# EAGLE design LDAQ-MOD-4AMPINP (EAGLE 6.6.0)
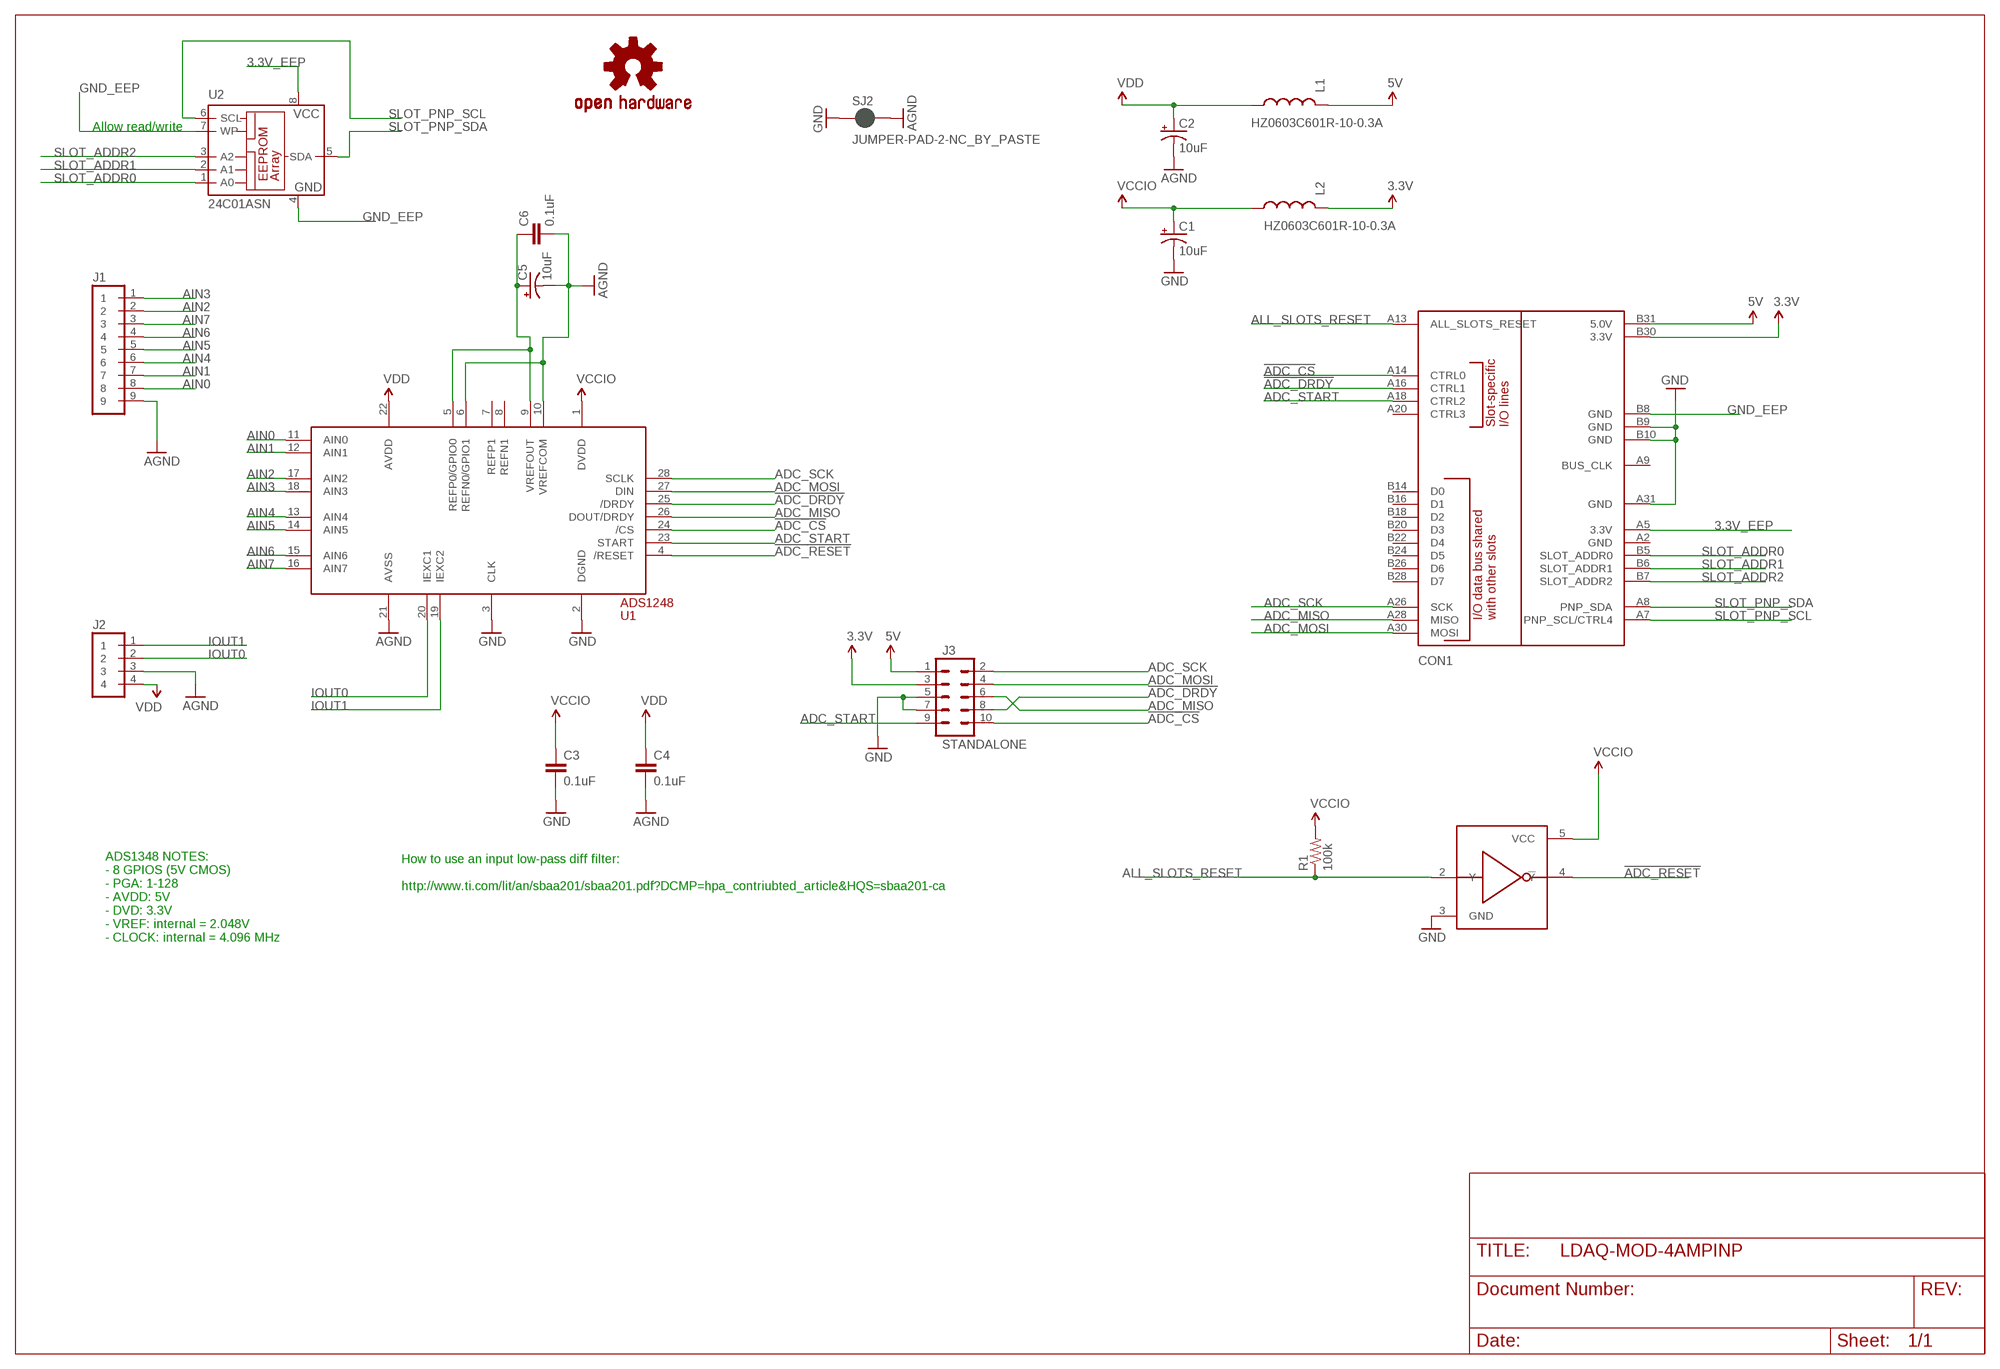
[diagram p0: schematic, sheet 1]

## Parts
C1  10uF  CAP_POL1206  [EIA3216]
C2  10uF  CAP_POL1206  [EIA3216]
C3  0.1uF  0.1UF-25V-5%(0603)  [0603-CAP]
C4  0.1uF  0.1UF-25V-5%(0603)  [0603-CAP]
C5  10uF  CAP_POL1206  [EIA3216]
C6  0.1uF  0.1UF-25V-5%(0603)  [0603-CAP]
CON1  BOARD  LIBREDAQ_DAUGHTER_BOARDPCIE-64-SIZE2-PADS  [PCI-E_64_EDGE_63X50_PADS-ONLY]
J1  SCREWTERMINAL-3.5MM-9  [SCREWTERMINAL-3.5MM-9]
J2  SCREWTERMINAL-3.5MM-4  [SCREWTERMINAL-3.5MM-4]
J3  STANDALONE  M05X2PTH  [AVR_ICSP]
L1  HZ0603C601R-10-0.3A  INDUCTOR0603  [0603]
L2  HZ0603C601R-10-0.3A  INDUCTOR0603  [0603]
LOGO1  OSHW-LOGOL  [OSHW-LOGO-L]
R1  100k  100KOHM-1/10W-1%(0603)  [0603-RES]
SJ2  JUMPER-PAD-2-NC_BY_PASTE  [PAD-JUMPER-2-NC_BY_PASTE_YES_SILK]
U1  ADS1248  [TSSOP-28_4MM]
U2  24C01ASN  [SO-08]
U3  74AHCT1G04  [SOT353-SC70-5]

## Nets
3.3V: CON1.B30(3.3V) J3.3 L2.1
3.3V_EEP: CON1.A5(3.3V) U2.8(VCC)
5V: CON1.B31(5.0V) J3.1 L1.1
!ADC_CS: CON1.A14(CTRL0) J3.10 U1.24(/CS)
!ADC_DRDY: CON1.A16(CTRL1) J3.8 U1.25(/DRDY)
!ADC_RESET: U1.4(/RESET) U3.4(!Y)
ADC_MISO: CON1.A28(MISO) J3.6 U1.26(DOUT/DRDY)
ADC_MOSI: CON1.A30(MOSI) J3.4 U1.27(DIN)
ADC_SCK: CON1.A26(SCK) J3.2 U1.28(SCLK)
ADC_START: CON1.A18(CTRL2) J3.9 U1.23(START)
AGND: C2.C(-) C4.2 C5.C(-) C6.2 J1.9 J2.3 SJ2.2 U1.6(REFN0/GPIO1) U1.10(VREFCOM) U1.21(AVSS)
AIN0: J1.8 U1.11(AIN0)
AIN1: J1.7 U1.12(AIN1)
AIN2: J1.2 U1.17(AIN2)
AIN3: J1.1 U1.18(AIN3)
AIN4: J1.6 U1.13(AIN4)
AIN5: J1.5 U1.14(AIN5)
AIN6: J1.4 U1.15(AIN6)
AIN7: J1.3 U1.16(AIN7)
ALL_SLOTS_RESET: CON1.A13(ALL_SLOTS_RESET) R1.1 U3.2(Y)
GND: C1.C(-) C3.2 CON1.A31(GND) CON1.B9(GND) CON1.B10(GND) J3.5 J3.7 SJ2.1 U1.2(DGND) U1.3(CLK) U3.3(GND)
GND_EEP: CON1.B8(GND) U2.4(GND) U2.7(WP)
IOUT0: J2.2 U1.20(IEXC1)
IOUT1: J2.1 U1.19(IEXC2)
N$1: C5.A(+) C6.1 U1.5(REFP0/GPIO0) U1.9(VREFOUT)
SLOT_ADDR0: CON1.B5(SLOT_ADDR0) U2.1(A0)
SLOT_ADDR1: CON1.B6(SLOT_ADDR1) U2.2(A1)
SLOT_ADDR2: CON1.B7(SLOT_ADDR2) U2.3(A2)
SLOT_PNP_SCL: CON1.A7(PNP_SCL/CTRL4) U2.6(SCL)
SLOT_PNP_SDA: CON1.A8(PNP_SDA) U2.5(SDA)
VCCIO: C1.A(+) C3.1 L2.2 R1.2 U1.1(DVDD) U3.5(VCC)
VDD: C2.A(+) C4.1 J2.4 L1.2 U1.22(AVDD)
Unconnected: CON1.A2(GND) CON1.A9(BUS_CLK) CON1.A20(CTRL3) CON1.B14(D0) CON1.B16(D1) CON1.B18(D2) CON1.B20(D3) CON1.B22(D4) CON1.B24(D5) CON1.B26(D6) CON1.B28(D7) U1.7(REFP1) U1.8(REFN1)

## Notes on the sheet
- Allow read/write
- How to use an input low-pass diff filter:
  
  http://www.ti.com/lit/an/sbaa201/sbaa201.pdf?DCMP=hpa_contriubted_article&HQS=sbaa201-ca
- ADS1348 NOTES:
  - 8 GPIOS (5V CMOS)
  - PGA: 1-128
  - AVDD: 5V
  - DVD: 3.3V
  - VREF: internal = 2.048V
  - CLOCK: internal = 4.096 MHz

## Library data of the parts
C1 C2 C5 = SparkFun-Capacitors:CAP_POL: Capacitor Polarized These are standard SMD and PTH capacitors. Normally 10uF, 47uF, and 100uF in electrolytic and tantalum varieties. Always verify the external diameter of the through hole cap, it varies with capacity, voltage, and manufacturer. The EIA devices should be standard.
C3 C4 C6 = SparkFun-Capacitors:0.1UF-25V-5%(0603): CAP-08604; PROD_ID: CAP-08604
CON1 = libredaq-comps:LIBREDAQ_DAUGHTER_BOARD: LibreDAQ Expansion board (PCI-E form)
J1 = libredaq-comps:SCREWTERMINAL-3.5MM-9
J2 = libredaq-comps:SCREWTERMINAL-3.5MM-4
J3 = libredaq-comps:M05X2: Header 5x2 Standard 10-pin dual row 0.1" header. Commonly used with AVR-ISP. Use with Spark Fun Electronics SKU: PRT-00778
L1 L2 = SparkFun-Passives:INDUCTOR: Inductors Basic Inductor/Choke - 0603 and 1206. Footprints are not proven and vary greatly between part numbers. SRN6045- 33uH, 20% 1.4A SDR0403-560KL - 56uH, 10%, 500mA RMS/740mA peak
LOGO1 = SparkFun-Aesthetics:OSHW-LOGO: Open Source Hardware Logo This logo indicates the piece of hardware it is found on incorporates a OSHW license and/or adheres to the definition of open source hardware found here: http://freedomdefined.org/OSHW
R1 = SparkFun-Resistors:100KOHM-1/10W-1%(0603): RES-07828; PROD_ID: RES-07828
SJ2 = SparkFun-Passives:JUMPER-PAD-2-NC_BY_PASTE
U1 = libredaq-comps:ADS1248: ADS1248: 24-Bit Analog-to-Digital Converters for Temperature Sensors
U2 = libredaq-comps:24C*: Serial EEPROM 1 K/2 K/4 K; MPN: AT24C01BN-SH-B; OC_FARNELL: 1362638; OC_NEWARK: 50M3313
U3 = libredaq-comps:74AHCT1G04: 74AHCT1G04SE: 1 gate inverter

## Board
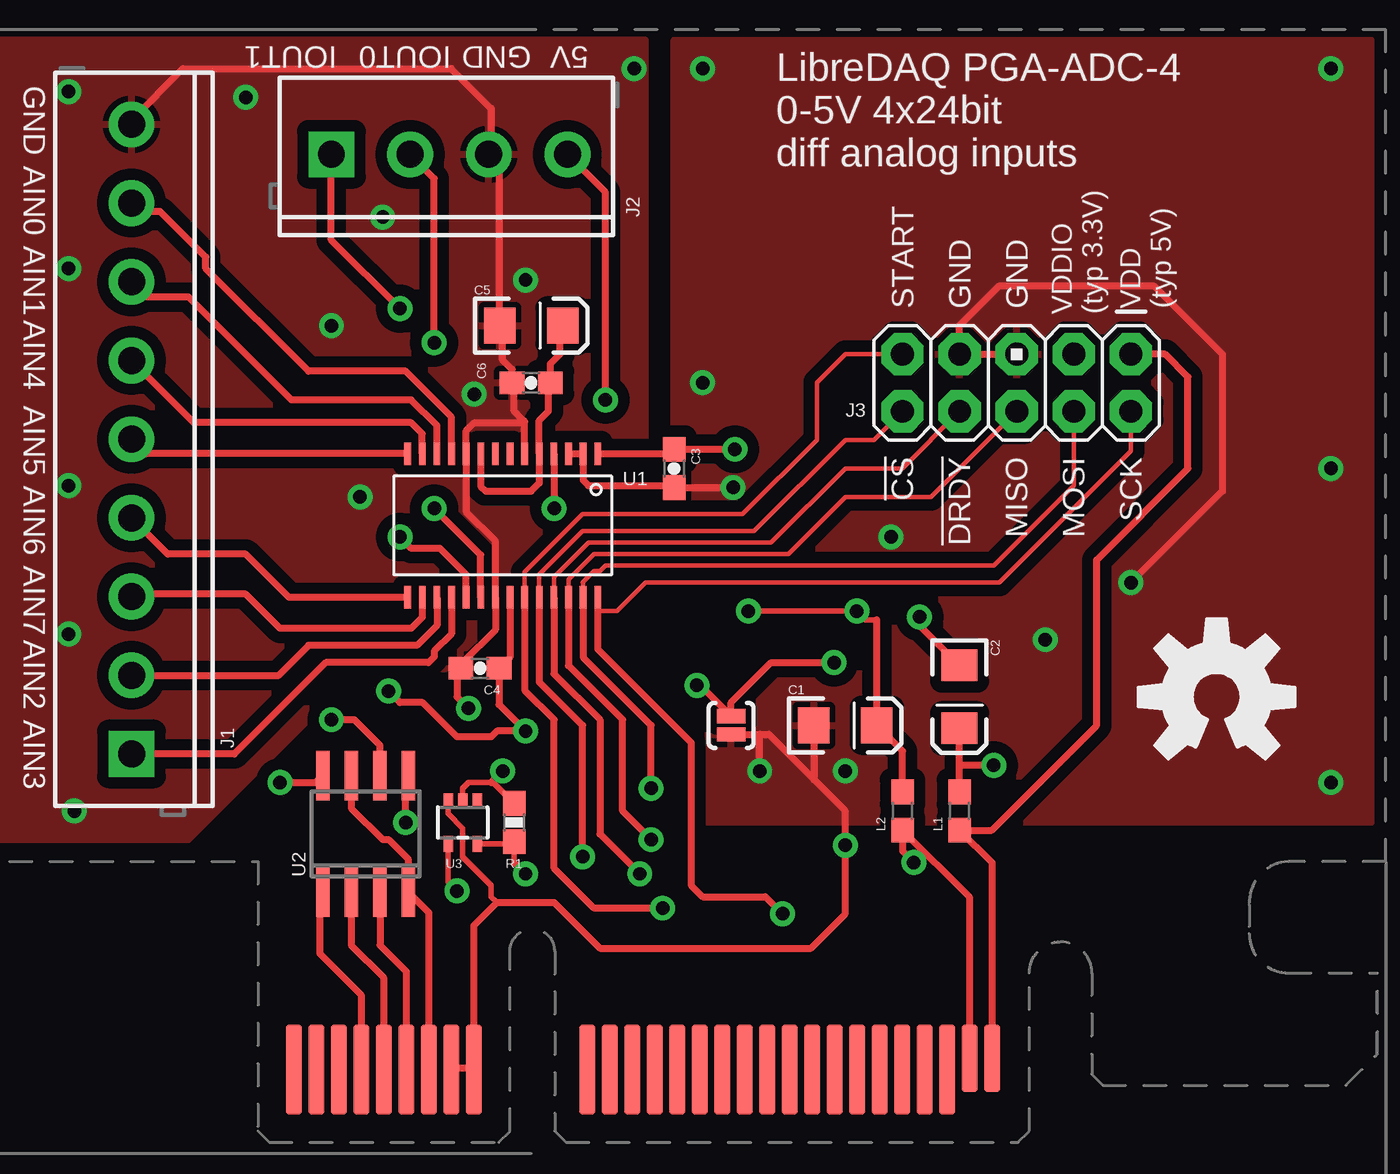
[diagram p1: board, top side]
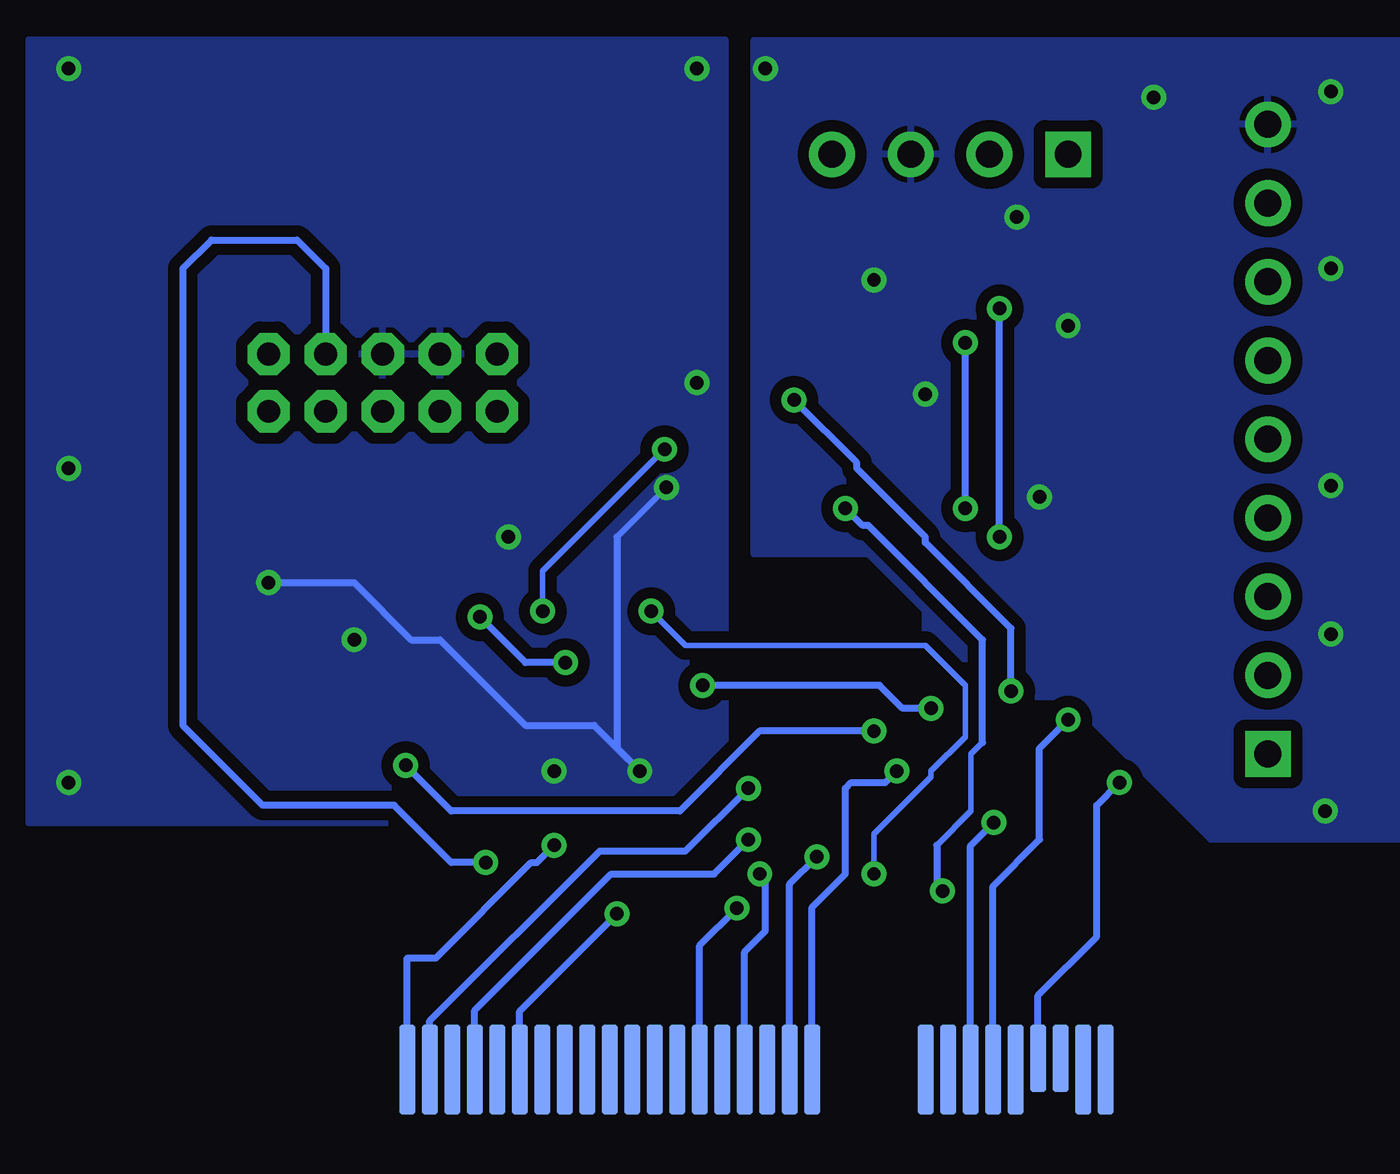
[diagram p2: board, bottom side, seen from below]

No outline drawn. Coordinates in mm, seen from the top.
Copper layers (1*16): Top 0.035mm / dielectric 1.5mm / Bottom 0.035mm
Design rules "LibreDAQ": minimum track width 8mil, minimum drill 20mil, track to track 8mil, track to pad 7mil, pad to pad 7mil, via to via 8mil, smd to smd 7mil, copper to edge 6mil, drill to drill 8mil, minimum pad ring 12mil, minimum via ring 10mil, stop-mask expansion 4mil, vias tented up to drill 25mil, thermal gap 10mil

### Footprints (pad centres in the part's own frame; a part is rotated, then mirrored left to right if it is on the bottom)
EIA3216 = smd 1.4 x 1.6: A 1.4,0; C -1.4,0
0603-CAP = smd 1.1 x 1: 1 -0.85,0; 2 0.85,0
PCI-E_64_EDGE_63X50_PADS-ONLY = smd 0.7 x 4 bottom: A2 -10.55,3.75; A3 -9.55,3.75; A6 -6.55,3.75; A7 -5.55,3.75; A8 -4.55,3.75; A9 -3.55,3.75; A10 -2.55,3.75; A13 2.5,3.75; A14 3.5,3.75; A15 4.5,3.75; A16 5.5,3.75; A17 6.5,3.75; A18 7.5,3.75; A19 8.5,3.75; A20 9.5,3.75; A21 10.5,3.75; A22 11.5,3.75; A23 12.5,3.75; A24 13.5,3.75; A25 14.5,3.75; A26 15.5,3.75; A27 16.5,3.75; A28 17.5,3.75; A29 18.5,3.75; A30 19.5,3.75; A31 20.5,3.75 | smd 0.7 x 3 bottom: A4 -8.55,4.25; A5 -7.55,4.25 | smd 0.7 x 4: B2 -10.55,3.75; B3 -9.55,3.75; B4 -8.55,3.75; B5 -7.55,3.75; B6 -6.55,3.75; B7 -5.55,3.75; B8 -4.55,3.75; B9 -3.55,3.75; B10 -2.55,3.75; B13 2.5,3.75; B14 3.5,3.75; B15 4.5,3.75; B16 5.5,3.75; B17 6.5,3.75; B18 7.5,3.75; B19 8.5,3.75; B20 9.5,3.75; B21 10.5,3.75; B22 11.5,3.75; B23 12.5,3.75; B24 13.5,3.75; B25 14.5,3.75; B26 15.5,3.75; B27 16.5,3.75; B28 17.5,3.75; B29 18.5,3.75 | smd 0.7 x 3: B30 19.5,4.25; B31 20.5,4.25
SCREWTERMINAL-3.5MM-9 = drill 1.2 pad 2.032 square: 1 0,0 | drill 1.2 pad 2.032: 2 3.5,0; 3 7,0; 4 10.5,0; 5 14,0; 6 17.5,0; 7 21,0; 8 24.5,0; 9 28,0
SCREWTERMINAL-3.5MM-4 = drill 1.2 pad 2.032 square: 1 0,0 | drill 1.2 pad 2.032: 2 3.5,0; 3 7,0; 4 10.5,0
AVR_ICSP = drill 1.016 pad 1.88 octagon: 1 -1.27,5.08; 2 1.27,5.08; 3 -1.27,2.54; 4 1.27,2.54; 5 -1.27,0; 6 1.27,0; 7 -1.27,-2.54; 8 1.27,-2.54; 9 -1.27,-5.08; 10 1.27,-5.08
0603 = smd 1.1 x 1: 1 -0.85,0; 2 0.85,0
0603-RES = smd 1.1 x 1: 1 -0.85,0; 2 0.85,0
PAD-JUMPER-2-NC_BY_PASTE_YES_SILK = smd 0.635 x 1.27: 1 -0.401,0; 2 0.413,0
TSSOP-28_4MM = smd 1 x 0.3: 1 -3.2,4.225; 2 -3.2,3.575; 3 -3.2,2.925; 4 -3.2,2.275; 5 -3.2,1.625; 6 -3.2,0.975; 7 -3.2,0.325; 8 -3.2,-0.325; 9 -3.2,-0.975; 10 -3.2,-1.625; 11 -3.2,-2.275; 12 -3.2,-2.925; 13 -3.2,-3.575; 14 -3.2,-4.225; 15 3.2,-4.225; 16 3.2,-3.575; 17 3.2,-2.925; 18 3.2,-2.275; 19 3.2,-1.625; 20 3.2,-0.975; 21 3.2,-0.325; 22 3.2,0.325; 23 3.2,0.975; 24 3.2,1.625; 25 3.2,2.275; 26 3.2,2.925; 27 3.2,3.575; 28 3.2,4.225
SO-08 = smd 0.6 x 2.2: 1 -1.905,-2.6; 2 -0.635,-2.6; 3 0.635,-2.6; 4 1.905,-2.6; 5 1.905,2.6; 6 0.635,2.6; 7 -0.635,2.6; 8 -1.905,2.6
SOT353-SC70-5 = smd 0.42 x 0.7: 1 -0.65,-0.95; 2 0,-0.95; 3 0.65,-0.95; 4 0.65,0.95; 5 -0.65,0.95

### Placement (x,y rotation side)
C1  13.97,19.05 0 top
C2  19.05,20.32 270 top
C3  6.35,30.48 270 top
C4  -2.29,21.59 180 top
C5  0,36.83 0 top
C6  0,34.29 180 top
CON1  0,0 0 top
J1  -17.78,17.78 90 top
J2  -8.89,44.45 0 top
J3  21.59,34.29 270 top
L1  19.05,15.24 90 top
L2  16.51,15.24 90 top
LOGO1  30.48,20.32 0 top
R1  -0.76,14.73 270 top
SJ2  8.89,19.05 90 top
U1  -1.27,27.94 270 top
U2  -7.37,14.22 0 top
U3  -3.05,14.73 180 top

### Tracks (layer width: path | path; a pad name or v marks a point on that pad's centre or on a via)
3.3V  (via drill 0.6)
  Top 0.305: CON1.B30 19.5,11.4 L2.1 16.51,13.46 v17.02,12.95
  Bottom 0.305: v17.02,12.95 18.54,12.95 21.08,15.49 26.92,15.49 30.48,19.05 30.48,39.37 29.21,40.64 25.4,40.64 24.13,39.37 J3.3
3.3V_EEP  (via drill 0.6)
  Top 0.305: v-11.18,16.51 -9.59,16.51 U2.8
  Bottom 0.305: CON1.A5 -7.55,7.04 -10.16,9.65 -10.16,15.49 v-11.18,16.51
5V
  Top 0.305: CON1.B31 20.5,12.94 L1.1 20.49,14.39 25.15,19.05 25.15,26.42 29.21,30.48 29.21,34.54 28.19,35.56 J3.1
!ADC_CS  (via drill 0.6)
  Top 0.203: U1.24 0.35,25.75 2.29,27.69 9.91,27.69 13.97,31.75 15.24,31.75 J3.10
  Top 0.305: U1.24 0.35,20.98 2.29,19.05 v2.29,13.21
  Bottom 0.305: CON1.A14 3.5,11.99 v2.29,13.21
!ADC_DRDY  (via drill 0.6)
  Top 0.203: U1.25 1,25.64 2.54,27.18 10.67,27.18 13.97,30.48 16.51,30.48 J3.8
  Top 0.305: U1.25 1,21.35 3.05,19.3 3.05,14.22 v4.83,12.45
  Bottom 0.305: CON1.A16 5.5,8.98 4.57,9.91 4.57,12.19 v4.83,12.45
!ADC_RESET  (via drill 0.6)
  Top 0.254: U3.4 -3.7,12.08 v-3.3,11.68
  Top 0.305: U1.4 1,28.71 v1.02,28.7
  Bottom 0.254: -3.05,13.72 -4.57,15.24 -4.57,17.78 -5.08,18.29
  Bottom 0.305: v1.02,28.7 0.25,27.94 0,27.94 -5.08,22.86 -5.08,18.29 | -3.05,13.72 -3.05,11.94 v-3.3,11.68
ADC_MISO  (via drill 0.6)
  Top 0.203: U1.26 1.66,25.53 2.79,26.67 11.43,26.67 13.97,29.21 17.78,29.21 J3.6
  Top 0.305: U1.26 1.66,21.71 4.06,19.3 4.06,15.24 v5.33,13.97
  Bottom 0.305: CON1.A28 17.5,6.38 11.43,12.45 6.86,12.45 v5.33,13.97
ADC_MOSI  (via drill 0.6)
  Top 0.203: J3.4 24.13,29.72 20.57,26.16 3.3,26.16 3.05,25.91 2.79,25.91 2.29,25.4 2.31,25.38 U1.27
  Top 0.305: U1.27 2.31,22.08 5.33,19.05 v5.33,16.26
  Bottom 0.305: CON1.A30 19.5,5.9 11.94,13.46 8.13,13.46 v5.33,16.26
ADC_SCK  (via drill 0.6)
  Top 0.203: J3.2 26.67,31.24 20.83,25.4 5.08,25.4 3.81,24.13 2.96,24.13
  Top 0.305: U1.28 2.96,24.13 2.96,22.45 7.11,18.29 7.11,11.94 7.62,11.43 10.41,11.43 v11.18,10.67
  Bottom 0.305: CON1.A26 15.5,6.34 v11.18,10.67
ADC_START  (via drill 0.6)
  Top 0.203: U1.23 -0.29,25.87 2.29,28.45 9.4,28.45 12.7,31.75 12.7,34.29 13.97,35.56 J3.9
  Top 0.305: U1.23 -0.29,20.61 1.02,19.3 1.02,12.7 2.79,10.92 v5.84,10.92
  Bottom 0.305: CON1.A18 7.5,9.26 v5.84,10.92
AGND  (via drill 0.6)
  Top 0.305: U1.6 -0.29,32.55 -0.38,32.64 | -0.38,32.64 -0.76,33.02 -0.76,34.2 C6.2 -0.85,34.89 -1.27,35.31 -1.27,36.7 C5.C -1.4,43.96 J2.3 -1.78,44.56 -1.78,46.48 -3.56,48.26 -15.49,48.26 -17.78,45.97 J1.9 | C4.2 -3.05,21.68 -3.05,21.84 | -0.38,32.64 -0.51,32.51 -2.54,32.51 -2.9,32.16 U1.10 -2.9,28.55 -1.59,27.25 U1.21 -1.59,23.3 -3.05,21.84 | -3.05,21.84 -3.3,21.59 -3.3,20.32 v-2.79,19.81 | v7.37,20.83 7.53,20.83 SJ2.2 8.89,20.07 10.67,21.84 v13.46,21.84 | v17.27,23.88 17.27,23.5 C2.C
  Bottom 0.305: v-2.79,19.81 -1.52,19.81 -0.51,20.83 v7.37,20.83 | v13.46,21.84 15.24,21.84 v17.27,23.88
  other vias: -20.32,15.24 -20.57,23.11 -20.57,29.72 -20.57,39.37 -20.57,47.24 -12.7,46.99 4.57,48.26 -8.89,36.83 -7.62,29.21 -2.54,33.78 -0.25,38.86 -6.6,41.66
  pour Bottom (isolate 0.508): -24.13,49.53 -24.13,13.97 -15.24,13.97 -8.89,20.32 -5.08,20.32 -2.54,22.86 -2.54,24.13 0,26.67 5.08,26.67 5.08,48.26 5.08,49.53
  pour Top (isolate 0.508): -24.13,49.53 -24.13,13.97 -15.24,13.97 -8.89,20.32 -5.08,20.32 -2.54,22.86 -2.54,24.13 0,26.67 5.08,26.67 5.08,48.26 5.08,49.53
AIN0
  Top 0.305: U1.11 -3.54,32.76 -5.59,34.8 -9.91,34.8 -14.48,39.37 -14.48,39.88 -16.51,41.91 -17.41,41.91 J1.8
AIN1
  Top 0.305: U1.12 -4.2,32.39 -5.33,33.53 -10.67,33.53 -15.24,38.1 -17.1,38.1 J1.7
AIN2
  Top 0.305: J1.2 -11.23,21.28 -9.91,22.61 -5.08,22.61 -4.2,23.49 U1.17
AIN3
  Top 0.305: J1.1 -13.21,17.78 -9.14,21.84 -4.57,21.84 -4.32,22.1 -4.32,22.35 -3.54,23.12 U1.18
AIN4
  Top 0.305: U1.13 -4.84,32.02 -5.33,32.51 -15.01,32.51 J1.6
AIN5
  Top 0.305: U1.14 -17.14,31.14 J1.5
AIN6
  Top 0.305: U1.15 -10.77,24.74 -12.7,26.67 -16.17,26.67 J1.4
AIN7
  Top 0.305: U1.16 -4.84,23.86 -5.33,23.37 -11.18,23.37 -12.7,24.89 -17.67,24.89 J1.3
ALL_SLOTS_RESET  (via drill 0.6)
  Top 0.254: U3.2 -3.05,16.26 -2.79,16.51 -1.78,16.51 -1.69,16.51 R1.1
  Top 0.305: v-1.27,17.02 -1.78,16.51
  Bottom 0.305: CON1.A13 2.5,10.96 1.02,12.45 1.02,16.26 0.76,16.51 -0.76,16.51 v-1.27,17.02
GND  (via drill 0.6)
  Top 0.254: U3.3 -3.7,15.13 -3.05,14.48 -3.05,13.21 -1.78,11.94 -1.78,11.43 -1.52,11.18
  Top 0.305: 12.7,18.92 C1.C 12.57,16.64 | SJ2.1 10.16,18.65 | 10.16,18.65 10.56,18.65 12.57,16.64 | 12.57,16.64 13.97,15.24 v13.97,13.72 13.97,10.67 12.45,9.14 3.05,9.14 1.02,11.18 -1.52,11.18 -2.55,10.15 CON1.B10 -2.55,3.8 -2.54,3.81 -3.49,3.81 CON1.B9 | U1.3 U1.2 2.31,29.95 2.54,29.72 6.26,29.72 C3.2 v8.98,29.63 | v10.16,17.02 10.16,18.65 | J3.5 J3.7 19.05,36.83 20.83,38.61 27.69,38.61 30.73,35.56 30.73,29.46 v26.67,25.4
  Bottom 0.254: 11.18,27.43 v8.98,29.63
  Bottom 0.305: CON1.A31 20.5,8.71 19.23,8.71 14.99,12.95 14.73,12.95 v13.97,13.72 | 11.18,27.43 11.18,18.03 v10.16,17.02 12.19,19.05 15.24,19.05 19.05,22.86 20.32,22.86 22.86,25.4 v26.67,25.4
  other vias: 35.56,48.26 7.62,48.26 7.62,34.29 35.56,30.48 35.56,16.51 22.86,22.86 13.97,17.02 16,27.43
  pour Bottom (isolate 0.508): 6.35,49.53 37.34,49.53 37.34,14.73 6.35,14.73
  pour Top (isolate 0.508): 6.35,49.53 37.34,49.53 37.34,14.73 6.35,14.73
GND_EEP
  Top 0.305: U2.7 -8,15.37 -6.6,13.97 -6.35,13.97 -5.46,13.08 U2.4 -4.55,10.71 CON1.B8
IOUT0  (via drill 0.6)
  Top 0.305: U1.20 -2.25,26.63 v-4.32,28.7 | v-4.32,36.07 -4.32,43.38 J2.2
  Bottom 0.305: v-4.32,28.7 v-4.32,36.07
IOUT1  (via drill 0.6)
  Top 0.305: U1.19 -2.9,25.75 -4.06,26.92 -5.33,26.92 v-5.84,27.43 | v-5.84,37.59 -8.89,40.64 J2.1
  Bottom 0.305: v-5.84,27.43 v-5.84,37.59
N$1
  Top 0.305: C5.A 1.27,36.7 1.27,35.56 0.85,35.14 C6.1 0.76,34.2 0.76,33.02 0.35,32.61 U1.5 0.35,29.82 0,29.46 -2.03,29.46 -2.25,29.68 U1.9
SLOT_ADDR0
  Top 0.305: CON1.B5 -7.55,7.04 -9.4,8.89 -9.4,11.5 U2.1
SLOT_ADDR1
  Top 0.305: CON1.B6 -6.55,7.82 -8,9.27 U2.2
SLOT_ADDR2
  Top 0.305: U2.3 -6.73,9.27 -5.55,8.09 CON1.B7
SLOT_PNP_SCL  (via drill 0.6)
  Top 0.305: v-8.89,19.3 -7.87,19.3 -6.73,18.16 U2.6
  Bottom 0.305: CON1.A7 -5.55,11.9 -7.62,13.97 -7.62,18.03 v-8.89,19.3
SLOT_PNP_SDA  (via drill 0.6)
  Top 0.305: v-5.59,14.73 -5.59,16.7 U2.5
  Bottom 0.305: CON1.A8 -4.55,13.69 v-5.59,14.73
VCCIO  (via drill 0.6)
  Top 0.254: 15.37,23.75 14.86,23.75 v14.48,24.13 v9.65,24.13 | U3.5 -0.86,13.78 R1.2 -0.76,12.95 v-0.25,12.45
  Top 0.305: L2.2 16.51,17.91 C1.A 15.37,23.75 | U1.1 6.16,31.14 C3.1 v9.06,31.33
  Bottom 0.254: v14.48,24.13 14.48,25.91 v9.06,31.33 | v-0.25,12.45 -0.25,14.22 -2.79,16.76 -2.79,17.02 -4.32,18.54 -4.32,20.83 -2.54,22.61 8.13,22.61 v9.65,24.13
VDD  (via drill 0.6)
  Top 0.305: U1.22 -0.94,22.08 C4.1 -1.44,19.98 v-0.25,18.8 -1.52,18.8 -1.78,18.54 -3.3,18.54 -4.83,20.07 -5.84,20.07 v-6.35,20.57 | L1.2 19.05,17.27 | 19.05,17.27 C2.A | v20.57,17.27 19.05,17.27 | v3.3,33.53 3.3,42.76 J2.4
  Bottom 0.305: v-0.25,18.8 4.83,18.8 8.38,15.24 18.54,15.24 v20.57,17.27 | v-6.35,20.57 -6.35,23.37 -2.54,27.18 -2.54,27.43 0.51,30.48 0.51,30.73 v3.3,33.53

### Text on the board
tPlace: IOUT1 | IOUT0 | GND | 5V | GND | AIN0 | LibreDAQ PGA-ADC-4 / 0-5V 4x24bit / diff analog inputs | AIN1 | START | GND | GND | VDD / (typ 5V) | AIN4 | VDDIO / (typ 3.3V) | AIN5 | !CS | !DRDY | MISO | MOSI | SCK | AIN6 | AIN7 | AIN2 | AIN3